# EasyEDA Pro project 无线充电发射端.epro, board PCB1
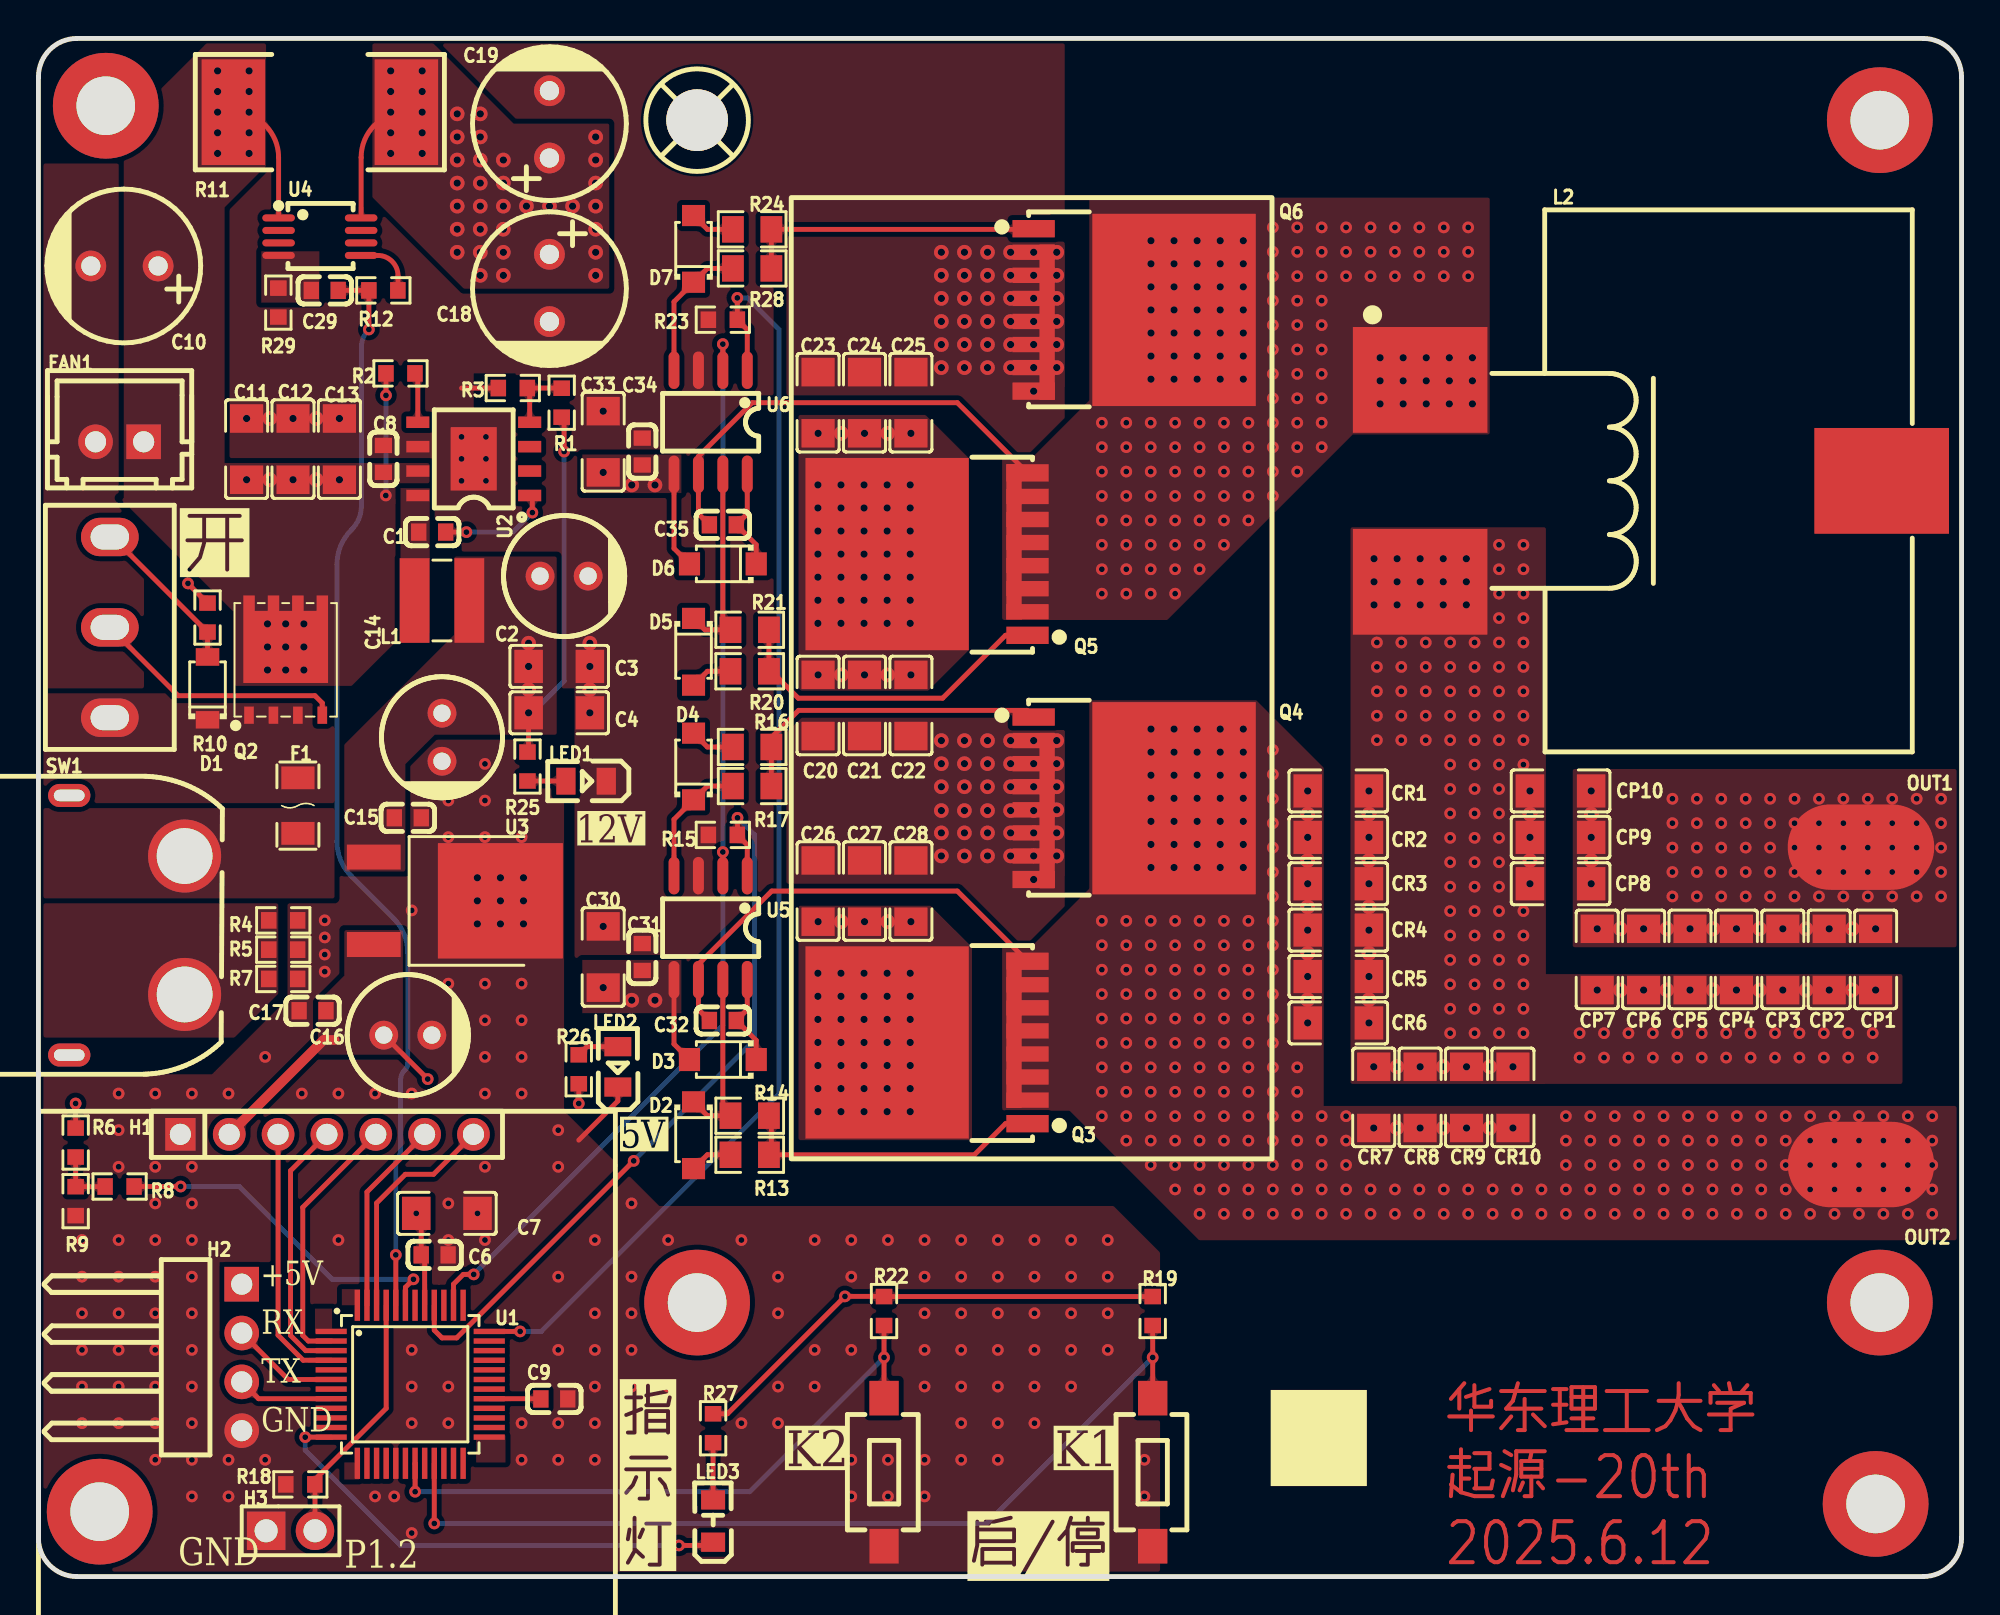
[diagram p1: board, top side]
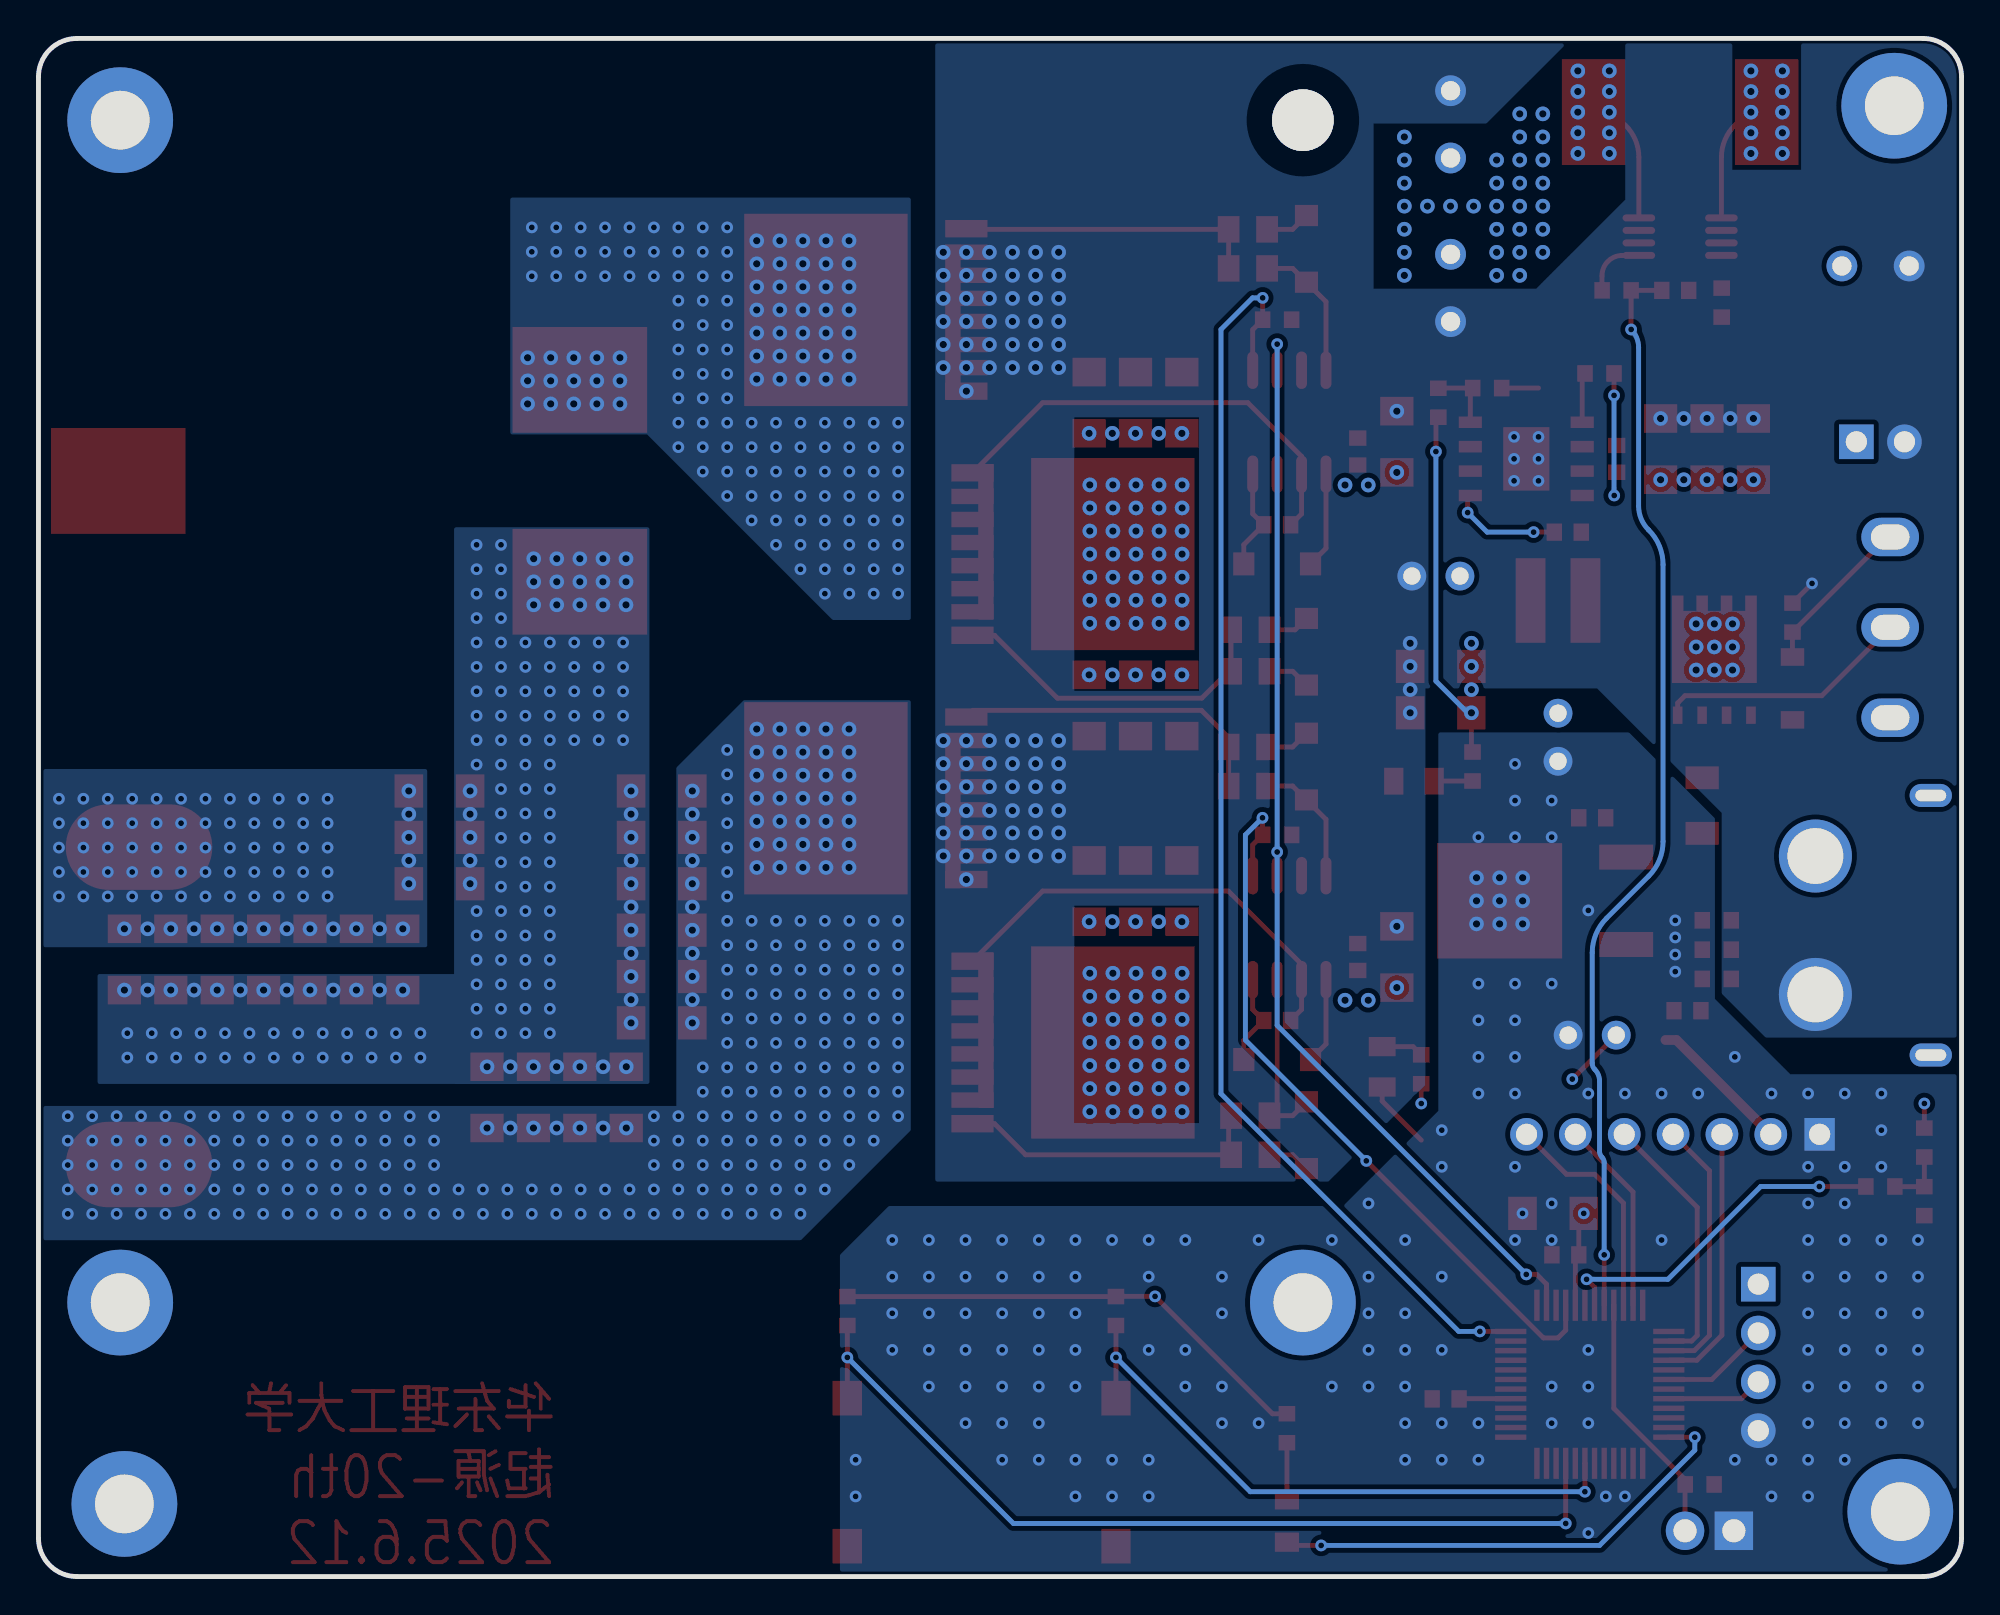
[diagram p2: board, bottom side, seen from below]

Outline 100 x 80 mm; copper layers: Top Layer, GND层, 电源层, Bottom Layer. Coordinates in mm from the lower left corner of the outline.
Outline path: 0,78 0,2 arc(0.59,0.59) 2,0 98,0 arc(99.41,0.59) 100,2 100,78 arc(99.41,79.41) 98,80 2,80 arc(0.59,79.41) 0,78
Stack: Top Layer 0.035mm 外层铜厚1oz / Dielectric1 0.2104mm 7628 RC49% 8.6mil / GND层 0.0152mm 内层铜厚 / Dielectric2 1.065mm 1.1mm H/HOZ Copper / 电源层 0.0152mm 内层铜厚 / Dielectric3 0.2104mm 7628 RC49% 8.6mil / Bottom Layer 0.035mm 外层铜厚1oz

## Design rules (mm)
template: xyf_v1.1
spacing copperThickness1oz (default): track to track 0.102, other pairs 0.152 to 0.3
spacing copperThickness2oz: track to track 0.203, other pairs 0.152 to 0.3
spacing 0焊盘板框间距: track to track 0.152, other pairs 0 to 0.3
spacing copperThicknessInner0.5oz: track to track 0.089, other pairs 0.152 to 0.3
track width copperThickness1oz (default): min 0.127, default 0.254, max 2.54
track width copperThickness2oz: min 0.203, default 0.254, max 2.54
track width copperThickness0.5oz: min 0.089, default 0.254, max 2.54
differential pair differentialPair (default): width min 0.127, default 0.254, max 2.54; gap min 0.152, default 0.152
via viaSize (default): diameter min 0.5, default 0.61, max 10; hole min 0.3, default 0.305, max 6.3
via viaSize2: diameter min 0.5, default 0.61, max 10; hole min 0.3, default 0.305, max 6.299
via viaSize4: diameter min 0.45, default 0.61, max 10; hole min 0.3, default 0.305, max 6.299

## Placement (name value [footprint] x y rotation side)
C1  100nF  [C0603]  20.47 54.32 0 top
C2  150uF  [CAP-TH_BD6.3-P2.50-D0.5-FD]  27.33 52.04 0 top
C3  10uF  [C1206]  27.08 47.34 180 top
C4  10uF  [C1206]  27.08 44.92 180 top
C6  100nF  [C0603]  20.6 16.73 180 top
C7  10uF  [C1206]  21.24 18.89 180 top
C8  100nF  [C0603]  17.94 58.13 270 top
C9  100nF  [C0603]  26.83 9.24 0 top
C10  220uF  [CAP-TH_BD8.0-P3.50-D0.6-FD]  4.47 68.17 180 top
C11  10uF  [C1206]  10.82 58.64 270 top
C12  10uF  [C1206]  13.24 58.64 270 top
C13  10uF  [C1206]  15.65 58.64 270 top
C14  150uF  [CAP-TH_BD6.3-P2.50-D0.5-FD]  20.98 43.66 270 top
C15  100nF  [C0603]  19.2 39.46 180 top
C16  150uF  [CAP-TH_BD6.3-P2.50-D0.5-FD]  19.2 28.16 0 top
C17  100nF  [C0603]  14.25 29.43 0 top
C18  220uF  [CAP-TH_BD8.0-P3.50-D0.6-FD]  26.57 67.02 270 top
C19  220uF  [CAP-TH_BD8.0-P3.50-D0.6-FD]  26.57 75.53 90 top
C20  10uF  [C1206]  40.54 45.31 270 top
C21  10uF  [C1206]  42.95 45.31 270 top
C22  10uF  [C1206]  45.37 45.31 270 top
C23  10uF  [C1206]  40.54 61.05 90 top
C24  10uF  [C1206]  42.95 61.05 90 top
C25  10uF  [C1206]  45.37 61.05 90 top
C26  10uF  [C1206]  40.54 35.65 90 top
C27  10uF  [C1206]  42.95 35.65 90 top
C28  10uF  [C1206]  45.37 35.65 90 top
C29  100nF  [C0603]  14.89 66.9 0 top
C30  10uF  [C1206]  29.37 32.22 270 top
C31  100nF  [C0603]  31.4 32.22 270 top
C32  100nF  [C0603]  35.59 28.92 180 top
C33  10uF  [C1206]  29.37 59.02 270 top
C34  100nF  [C0603]  31.4 58.51 270 top
C35  100nF  [C0603]  35.59 54.7 180 top
CN1  XT60PW-M  [CONN-TH_XT60PW-M]  4.6 33.88 0 top
CP1  1nF  [C1206]  95.53 32.1 270 top
CP2  1nF  [C1206]  93.12 32.1 270 top
CP3  1nF  [C1206]  90.71 32.1 270 top
CP4  4.3nF  [C1206]  88.29 32.1 270 top
CP5  4.3nF  [C1206]  85.88 32.1 270 top
CP6  4.3nF  [C1206]  83.47 32.1 270 top
CP7  4.3nF  [C1206]  81.05 32.1 270 top
CP8  10nF  [C1206]  79.15 36.03 180 top
CP9  10nF  [C1206]  79.15 38.45 180 top
CP10  10nF  [C1206]  79.15 40.86 180 top
CR1  68nF  [C1206]  67.59 40.86 180 top
CR2  68nF  [C1206]  67.59 38.45 180 top
CR3  68nF  [C1206]  67.59 36.03 180 top
CR4  10nF  [C1206]  67.59 33.62 0 top
CR5  10nF  [C1206]  67.59 31.21 0 top
CR6  10nF  [C1206]  67.59 28.8 0 top
CR7  10nF  [C1206]  69.43 24.92 90 top
CR8  1nF  [C1206]  71.85 24.92 90 top
CR9  1nF  [C1206]  74.26 24.92 90 top
CR10  1nF  [C1206]  76.67 24.92 90 top
D1  BZT52C12  [SOD-123_L2.7-W1.6-LS3.7-RD]  8.79 46.19 90 top
D2  1N5819HW  [SOD-123_L2.7-W1.6-LS3.8-RD]  34.06 22.95 270 top
D3  1N5819HW  [SOD-123_L2.7-W1.6-LS3.8-RD]  35.59 26.89 180 top
D4  1N5819HW  [SOD-123_L2.7-W1.6-LS3.8-RD]  34.06 42.13 90 top
D5  1N5819HW  [SOD-123_L2.7-W1.6-LS3.8-RD]  34.06 48.1 270 top
D6  1N5819HW  [SOD-123_L2.7-W1.6-LS3.8-RD]  35.59 52.67 180 top
D7  1N5819HW  [SOD-123_L2.7-W1.6-LS3.8-RD]  34.06 69.06 90 top
F1  JFC1206-2300FS  [F1206]  13.49 40.1 90 top
FAN1  ZX-XH2.54-2PZZ  [CONN-TH_2P-P2.50_HX25003-2A]  4.22 59.02 180 top
H1  PM254V-11-07-H85  [HDR-TH_7P-P2.54-V-F]  15 23 0 top
H2  PZ254R-11-04P  [HDR-TH_4P-P2.54-H-M-W10.4]  10.57 11.4 270 top
H3  PZ254V-11-02P  [HDR-TH_2P-P2.54-V-M]  13.11 2.38 0 top
K1  TS3625A  [KEY-SMD_L6.0-W3.5-LS8.4]  57.94 5.43 90 top
K2  TS3625A  [KEY-SMD_L6.0-W3.5-LS8.4]  43.97 5.43 90 top
L1  10uH  [IND-SMD_L4.1-W4.1_FTC404020S]  20.98 50.77 0 top
L2  4.7uH  [IND-SMD_3P-L28.0-W19.0-LS27.0]  83.85 56.99 270 top
LED1  NCD0805G1  [LED0805-R-RD]  28.48 41.37 180 top
LED2  NCD0805G1  [LED0805-R-RD]  30.13 26.51 90 top
LED3  XL-2012UPC  [LED0805-RD_PINK]  35.08 2.89 90 top
OUT1  -  [Test-Point-0.5mm]  94.77 37.94 0 top
OUT2  -  [Test-Point-0.5mm]  94.77 21.43 0 top
Q2  AGM60P100A  [TDSON-8_L5.9-W5.2-P1.27-BL]  12.86 46.58 0 top
Q3  HYG016N10NS1TA  [TOLL-8_L10.4-W9.9-P1.20-LS11.7-BL]  47.78 27.78 90 top
Q4  HYG016N10NS1TA  [TOLL-8_L10.4-W9.9-P1.20-LS11.7-BL]  55.4 40.48 270 top
Q5  HYG016N10NS1TA  [TOLL-8_L10.4-W9.9-P1.20-LS11.7-BL]  47.78 53.18 90 top
Q6  HYG016N10NS1TA  [TOLL-8_L10.4-W9.9-P1.20-LS11.7-BL]  55.4 65.88 270 top
QR1  -  [JLC-QRCODE-5x5]  66.58 7.21 0 top
R1  143kΩ  [R0603]  27.21 61.05 270 top
R2  10kΩ  [R0603]  18.82 62.58 0 top
R3  10kΩ  [R0603]  24.67 61.82 0 top
R4  0Ω  [R0603]  12.73 34.13 180 top
R5  0Ω  [R0603]  12.73 32.61 180 top
R6  10kΩ  [R0603]  1.93 22.57 90 top
R7  0Ω  [R0603]  12.73 31.08 180 top
R8  2kΩ  [R0603]  4.22 20.29 180 top
R9  1kΩ  [R0603]  1.93 19.53 90 top
R10  10kΩ  [R0603]  8.79 49.88 90 top
R11  5mΩ  [RES-SMD_L10.0-W5.2]  14.63 76.17 180 top
R12  10kΩ  [R0603]  17.94 66.9 0 top
R13  27Ω  [R0805]  36.99 21.94 0 top
R14  27Ω  [R0805]  36.99 23.97 0 top
R15  510kΩ  [R0603]  35.59 38.58 0 top
R16  27Ω  [R0805]  37.11 43.15 0 top
R17  27Ω  [R0805]  37.11 41.11 0 top
R18  10kΩ  [R0603]  13.62 4.79 0 top
R19  1kΩ  [R0603]  57.94 13.81 270 top
R20  27Ω  [R0805]  36.99 47.08 0 top
R21  27Ω  [R0805]  36.99 49.24 0 top
R22  1kΩ  [R0603]  43.97 13.81 270 top
R23  510kΩ  [R0603]  35.59 65.37 0 top
R24  27Ω  [R0805]  37.11 70.07 0 top
R25  4.7kΩ  [R0603]  25.43 42.13 90 top
R26  4.7kΩ  [R0603]  28.09 26.38 270 top
R27  4.7kΩ  [R0603]  35.08 7.71 90 top
R28  27Ω  [R0805]  37.11 68.04 0 top
R29  0Ω  [R0603]  12.47 66.26 90 top
SCREW1  -  [M3螺丝]  3.5 76.5 0 top
SCREW2  -  [M3螺丝#2]  34.25 75.75 0 top
SCREW3  -  [M3螺丝]  95.75 75.75 0 top
SCREW4  -  [M3螺丝]  3.18 3.37 0 top
SCREW5  -  [M3螺丝]  34.25 14.25 0 top
SCREW6  -  [M3螺丝]  95.75 14.25 0 top
SCREW7  -  [M3螺丝]  95.53 3.78 0 top
SW1  SS-12D10L5  [SW-TH_SS-12D10L5]  3.71 49.37 270 top
U1  AI8051U-34K64-QFP48  [LQFP-48_L7.0-W7.0-P0.50-LS9.0-BL_1]  19.33 10 270 top
U2  SCT2433STER  [ESOP-8_L4.9-W3.9-P1.27-LS6.0-BL-EP]  22.63 58.13 90 top
U3  MC7805BDTRKG  [TO-252-2_L6.6-W6.1-P4.57-LS9.9-TL-CW]  20.73 35.15 0 top
U4  AD8217BRMZ-R7  [MSOP-8_L3.0-W3.0-P0.65-LS5.0-BL]  14.63 69.69 270 top
U5  IR2184STRPBF  [SOIC-8_L5.0-W4.0-P1.27-LS6.0-BL]  34.95 33.75 180 top
U6  IR2184STRPBF  [SOIC-8_L5.0-W4.0-P1.27-LS6.0-BL]  34.95 60.04 180 top

## Footprints (pads in the part's own frame, mm; a bottom-side part is the same pattern mirrored in y, then rotated)
C0603
  rect 0.8x0.9 smd: 1(-0.7,0) 2(0.7,0)
C1206
  rect 1.485x1.728 smd: 1(-1.593,0) 2(1.593,0)
CAP-TH_BD6.3-P2.50-D0.5-FD
  round 1.5 hole 0.9: 1(-1.25,0) 2(1.25,0)
CAP-TH_BD8.0-P3.50-D0.6-FD
  round 1.6 hole 1: 1(-1.75,0) 2(1.75,0)
CONN-TH_2P-P2.50_HX25003-2A
  rect 1.8x1.8 hole 1.1: 1(-1.25,0)
  round 1.8 hole 1.1: 2(1.25,0)
CONN-TH_XT60PW-M
  round 3.8 hole 2.9: 1(3,-3.6) 2(3,3.6)
  oval 2.2x1.2 hole 1.6x0.6: 3(-3,6.75) 4(-3,-6.75)
ESOP-8_L4.9-W3.9-P1.27-LS6.0-BL-EP
  rect 0.6x1.2 smd: 1(-1.905,-2.909) 2(-0.635,-2.909) 3(0.635,-2.909) 4(1.905,-2.909) 5(1.905,2.909) 6(0.635,2.909) 7(-0.635,2.909) 8(-1.905,2.909)
  rect 3.3x2.4 smd: 9(0,0)
F1206
  rect 1.19x1.728 smd: 1(-1.445,0) 2(1.445,0)
HDR-TH_2P-P2.54-V-M
  rect 2x2 hole 1.2: 1(-1.27,0)
  round 2 hole 1.2: 2(1.27,0)
HDR-TH_4P-P2.54-H-M-W10.4
  rect 1.8x1.8 hole 1.1: 1(-3.81,0)
  round 1.8 hole 1.1: 2(-1.27,0) 3(1.27,0) 4(3.81,0)
HDR-TH_7P-P2.54-V-F
  rect 1.575x1.7 hole 1.1: 1(-7.62,0)
  round 1.7 hole 1.1: 2(-5.08,0) 3(-2.54,0) 4(0,0) 5(2.54,0) 6(5.08,0) 7(7.62,0)
IND-SMD_3P-L28.0-W19.0-LS27.0
  rect 5.5x7 smd: 1(-5.25,-12) 2(5.25,-12) 3(0,12)
IND-SMD_L4.1-W4.1_FTC404020S
  rect 1.55x4.4 smd: 1(-1.425,0) 2(1.425,0)
KEY-SMD_L6.0-W3.5-LS8.4
  rect 1.8x1.524 smd: 1(-3.85,0) 2(3.85,0)
LED0805-R-RD
  rect 1x1.399 smd: 1(1.05,0) 2(-1.05,0)
LED0805-RD_PINK
  rect 1x1.25 smd: 1(-1.1,0) 2(1.1,0)
LQFP-48_L7.0-W7.0-P0.50-LS9.0-BL_1
  rect 0.28x1.62 smd: 1(-2.75,-4.11) 2(-2.25,-4.11) 3(-1.75,-4.11) 4(-1.25,-4.11) 5(-0.75,-4.11) 6(-0.25,-4.11) 7(0.25,-4.11) 8(0.75,-4.11) 9(1.25,-4.11) 10(1.75,-4.11) 11(2.25,-4.11) 12(2.75,-4.11) 25(2.75,4.11) 26(2.25,4.11) 27(1.75,4.11) 28(1.25,4.11) 29(0.75,4.11) 30(0.25,4.11) 31(-0.25,4.11) 32(-0.75,4.11) 33(-1.25,4.11) 34(-1.75,4.11) 35(-2.25,4.11) 36(-2.75,4.11)
  rect 1.62x0.28 smd: 13(4.11,-2.75) 14(4.11,-2.25) 15(4.11,-1.75) 16(4.11,-1.25) 17(4.11,-0.75) 18(4.11,-0.25) 19(4.11,0.25) 20(4.11,0.75) 21(4.11,1.25) 22(4.11,1.75) 23(4.11,2.25) 24(4.11,2.75) 37(-4.11,2.75) 38(-4.11,2.25) 39(-4.11,1.75) 40(-4.11,1.25) 41(-4.11,0.75) 42(-4.11,0.25) 43(-4.11,-0.25) 44(-4.11,-0.75) 45(-4.11,-1.25) 46(-4.11,-1.75) 47(-4.11,-2.25) 48(-4.11,-2.75)
M3螺丝
  round 5.5 hole 3.05: 1(0,0)
M3螺丝#2
  round 3.2 hole 3.2: 1(0,0)
MSOP-8_L3.0-W3.0-P0.65-LS5.0-BL
  oval 0.364x1.692 smd: 1(-0.975,-2.146) 2(-0.325,-2.146) 3(0.325,-2.146) 4(0.975,-2.146) 5(0.975,2.146) 6(0.325,2.146) 7(-0.325,2.146) 8(-0.975,2.146)
R0603
  rect 0.806x0.864 smd: 1(-0.753,0) 2(0.753,0)
R0805
  rect 1.133x1.377 smd: 1(-1,0) 2(1,0)
RES-SMD_L10.0-W5.2
  rect 3.3x5.5 smd: 1(-4.5,0) 2(4.5,0)
SOD-123_L2.7-W1.6-LS3.7-RD
  rect 0.91x1.22 smd: 1(-1.635,0) 2(1.635,0)
SOD-123_L2.7-W1.6-LS3.8-RD
  rect 1.1x1.2 smd: 1(-1.735,0) 2(1.735,0)
SOIC-8_L5.0-W4.0-P1.27-LS6.0-BL
  oval 0.569x1.95 smd: 1(-1.905,-2.705) 2(-0.635,-2.705) 3(0.635,-2.705) 4(1.905,-2.705) 5(1.905,2.705) 6(0.635,2.705) 7(-0.635,2.705) 8(-1.905,2.705)
SW-TH_SS-12D10L5
  oval 2x3 hole 1.3x2: 1(-4.7,0) 2(0,0) 3(4.7,0)
TDSON-8_L5.9-W5.2-P1.27-BL
  rect 0.5x0.9 smd: 1(-1.905,-1.775) 2(-0.635,-1.775) 3(0.635,-1.775) 4(1.905,-1.775)
  custom 4.41x4.55 smd: 5(0,1.775)
Test-Point-0.5mm
  oval 7.62x4.445 smd: 1(0,0)
TO-252-2_L6.6-W6.1-P4.57-LS9.9-TL-CW
  rect 2.8x1.3 smd: 1(-3.292,2.273) 3(-3.292,-2.273)
  rect 6.5x6 smd: 2(3.292,0)
TOLL-8_L10.4-W9.9-P1.20-LS11.7-BL
  rect 0.9x2.2 smd: 1(-4.225,-3.65) 8(4.225,-3.65)
  rect 0.8x2.2 smd: 2(-3,-3.65) 3(-1.8,-3.65) 4(-0.6,-3.65) 5(0.6,-3.65) 6(1.8,-3.65) 7(3,-3.65)
  rect 8.08x0.8 smd: 8(0.64,-2.95)
  rect 10x8.5 smd: 9(0,3.65)

## Nets
As in the schematic.

Pads without a net: CN1 3 4; L2 3; SCREW1 1; SCREW2 1; SCREW3 1; SCREW4 1; SCREW5 1; SCREW6 1; SCREW7 1; U2 2 3; U4 2 3 6 7

## Via types
v1: diameter 0.61, hole 0.305, Top Layer to Bottom Layer, 676 vias
v2: diameter 0.762, hole 0.381, Top Layer to Bottom Layer, 426 vias

## Routing (per net, layer and track width the routed paths; a pad name or vN(x,y) marks a point on that pad's centre or on a via; arc(x,y) is an arc through that point)
+5V: length 93.6
  Top Layer w0.254: R19.1 R22.1 43.96,14.57 v1(41.94,14.57) 35.83,8.47 R27.2 ; R26.2 v1(28.09,24.61) ; v1(19.64,18.89) 19.9,18.63 C6.2 20.08,16.55 U1.41 ; C16.1 v1(20.24,25.88)
  Top Layer w0.508: H1.2 14.83,27.91 15.39,27.91
  电源层 w0.254: v1(28.09,24.61) 27.71,24.22 25.05,24.22 ; 25.05,24.22 23.4,25.88 v1(20.24,25.88) ; 25.05,24.22 25.05,20.16 26.44,18.76 37.75,18.76 v1(41.94,14.57) ; v1(19.64,18.89) 14.03,18.89 H1.2 9.92,15.86 H2.1
+12V: length 27.8
  Top Layer w0.254: U6.5 33.05,53.48 D6.2 ; v2(25.49,44.92) 25.49,42.94 R25.2 ; D3.2 33.05,27.7 U5.5 ; R1.2 27.33,60.17 v1(27.33,58.51)
  Bottom Layer w0.254: 25.56,44.92 25.68,44.92 27.33,46.58 v1(27.33,58.51)
  vias: v2(25.49,48.54) v2(25.49,47.34) v2(25.49,46.13) v2(29.37,57.43) v2(29.37,30.63) v2(30.85,56.77) v2(30.85,29.98) v2(32.06,56.77) v2(32.06,29.98)
+24V: length 42.3
  Top Layer w0.254: R2.1 v1(18.07,61.44) ; R6.2 v1(1.93,24.61) ; U4.1 12.49,73.81 arc(11.8,75.48) R11.2
  电源层 w0.254: v2(11.91,47.15) 10,47.15 3.71,40.86 3.71,26.38 v1(1.93,24.61)
  Bottom Layer w0.254: v1(18.07,61.44) 18.07,56.24 v1(18.06,56.23)
  vias: v2(9.31,78.31) v2(9.31,77.24) v2(9.31,76.17) v2(9.31,75.09) v2(9.31,74.02) v2(10.82,57.05) v2(10.95,78.31) v2(10.95,77.24) v2(10.95,76.17) v2(10.95,75.09) v2(10.95,74.02) v2(11.91,49.55) v2(11.91,48.35) v2(12.03,57.05) v2(12.86,49.55) v2(12.86,48.35) v2(12.86,47.15) v2(13.24,57.05) v2(13.8,49.55) v2(13.8,48.35) v2(13.8,47.15) v2(14.44,57.05) v2(15.65,57.05)
GND: length 3.6
  Top Layer w0.254: LED2.2 30.13,24.73 28.09,22.7
  vias: v1(2.26,17.5) v1(2.26,15.6) v1(2.26,13.69) v1(2.26,11.79) v1(2.26,9.88) v1(2.26,7.98) v1(4.17,25.12) v1(4.17,23.22) v1(4.17,21.31) v1(4.17,17.5) v1(4.17,15.6) v1(4.17,13.69) v1(4.17,11.79) v1(4.17,9.88) v1(4.17,7.98) v1(6.07,25.12) v1(6.07,21.31) v1(6.07,19.41) v1(6.07,17.5) v1(6.07,15.6) v1(6.07,13.69) v1(6.07,11.79) v1(6.07,9.88) v1(6.07,7.98) v1(6.07,6.07) v1(7.98,25.12) v1(7.98,21.31) v1(7.98,19.41) v1(7.98,17.5) v1(7.98,15.6) v1(7.98,13.69) v1(7.98,11.79) v1(7.98,9.88) v1(7.98,7.98) v1(7.98,6.07) v1(7.98,4.17) v1(9.88,25.12) v1(9.88,6.07) v1(9.88,4.17) v1(11.79,27.03) v1(11.79,6.07) v1(13.69,25.12) v1(14.89,34.13) v1(14.89,33.24) v1(14.89,32.35) v1(14.89,31.46) v1(15.6,25.12) v1(15.6,17.5) v1(17.5,25.12) v1(17.5,4.17) v1(18.5,4.17) v1(19.41,34.65) v1(19.41,25.12) v1(19.41,11.79) v1(19.41,9.88) v1(19.41,7.98) v1(19.41,2.26) v1(21.31,40.36) v1(21.31,38.46) v1(21.31,30.84) v1(21.31,19.41) v1(21.31,17.5) v1(21.31,9.88) v1(21.31,7.98) v1(22.83,18.89) v1(23.22,42.27) v1(23.22,40.36) v1(23.22,38.46) v1(23.22,30.84) v1(23.22,28.93) v1(23.22,27.03) v1(23.22,25.12) v1(23.22,21.31) v1(23.22,17.5) v1(25.12,38.46) v1(25.12,30.84) v1(25.12,28.93) v1(25.12,27.03) v1(25.12,25.12) v1(25.12,7.98) v1(25.12,6.07) v1(27.03,23.22) v1(27.03,21.31) v1(27.03,15.6) v1(27.03,11.79) v1(27.03,7.98) v1(27.03,6.07) v1(28.93,17.5) v1(28.93,13.69) v1(28.93,11.79) v1(28.93,9.88) v1(28.93,7.98) v1(28.93,6.07) v1(30.84,19.41) v1(30.84,15.6) v1(30.84,13.69) v1(30.84,11.79) v1(30.84,9.88) v1(32.74,17.5) v1(32.74,9.88) v1(36.55,17.5) v1(36.55,7.98) v1(38.46,15.6) v1(38.46,13.69) v1(38.46,9.88) v1(38.46,7.98) v1(40.36,17.5) v1(40.36,11.79) v1(40.36,9.88) v1(42.27,17.5) v1(42.27,15.6) v1(42.27,11.79) v1(42.27,6.07) v1(42.27,4.17) v1(44.17,17.5) v1(44.17,6.07) v1(44.17,4.17) v1(46.08,17.5) v1(46.08,15.6) v1(46.08,13.69) v1(46.08,11.79) v1(46.08,9.88) v1(46.08,6.07) v1(46.08,4.17) v1(47.98,17.5) v1(47.98,15.6) v1(47.98,13.69) v1(47.98,11.79) v1(47.98,9.88) v1(47.98,7.98) v1(47.98,6.07) v1(49.89,17.5) v1(49.89,15.6) v1(49.89,13.69) v1(49.89,11.79) v1(49.89,9.88) v1(49.89,7.98) v1(49.89,6.07) v1(51.79,17.5) v1(51.79,15.6) v1(51.79,13.69) v1(51.79,11.79) v1(51.79,9.88) v1(51.79,7.98) v1(53.7,17.5) v1(53.7,15.6) v1(53.7,13.69) v1(53.7,11.79) v1(53.7,9.88) v1(55.6,17.5) v1(55.6,15.6) v1(55.6,13.69) v1(55.6,11.79) v1(57.51,6.07) v1(57.51,4.17) v2(22.82,36.35) v2(22.82,35.15) v2(22.82,33.95) v2(24.02,36.35) v2(24.02,35.15) v2(24.02,33.95) v2(25.22,36.35) v2(25.22,35.15) v2(25.22,33.95)
PGND: length 3.4
  Top Layer w0.254: R10.2 7.78,51.65 v1(7.78,51.66) ; R3.1 22,61.82
  vias: v1(22,59.28) v1(22,58.13) v1(22,56.99) v1(23.27,59.28) v1(23.27,58.13) v1(23.27,56.99) v2(10.82,60.23) v2(12.03,60.23) v2(13.24,60.23) v2(14.44,60.23) v2(15.65,60.23) v2(28.67,48.54) v2(28.67,47.34) v2(28.67,46.13) v2(28.67,44.92) v2(29.37,60.61) v2(29.37,33.82) v2(46.95,68.88) v2(46.95,67.68) v2(46.95,66.48) v2(46.95,65.28) v2(46.95,64.08) v2(46.95,62.88) v2(46.95,43.48) v2(46.95,42.28) v2(46.95,41.08) v2(46.95,39.84) v2(46.95,38.68) v2(46.95,37.48) v2(48.15,68.88) v2(48.15,67.68) v2(48.15,66.48) v2(48.15,65.28) v2(48.15,64.08) v2(48.15,62.88) v2(48.15,43.48) v2(48.15,42.28) v2(48.15,41.08) v2(48.15,39.84) v2(48.15,38.68) v2(48.15,37.48) v2(49.35,68.88) v2(49.35,67.68) v2(49.35,66.48) v2(49.35,65.28) v2(49.35,64.08) v2(49.35,62.88) v2(49.35,43.48) v2(49.35,42.28) v2(49.35,41.08) v2(49.35,39.84) v2(49.35,38.68) v2(49.35,37.48) v2(50.55,68.88) v2(50.55,67.68) v2(50.55,66.48) v2(50.55,65.28) v2(50.55,64.08) v2(50.55,62.88) v2(50.55,43.48) v2(50.55,42.28) v2(50.55,41.08) v2(50.55,39.84) v2(50.55,38.68) v2(50.55,37.48) v2(51.75,68.88) v2(51.75,67.68) v2(51.75,66.48) v2(51.75,65.28) v2(51.75,64.08) v2(51.75,62.88) v2(51.75,61.66) v2(51.75,43.48) v2(51.75,42.28) v2(51.75,41.08) v2(51.75,39.84) v2(51.75,38.68) v2(51.75,37.48) v2(51.75,36.25) v2(52.95,68.88) v2(52.95,67.68) v2(52.95,66.48) v2(52.95,65.28) v2(52.95,64.08) v2(52.95,62.88) v2(52.95,43.48) v2(52.95,42.28) v2(52.95,41.08) v2(52.95,39.88) v2(52.95,38.68) v2(52.95,37.48)
ADC1: length 56.3
  Top Layer w0.254: U1.44 v1(18.58,16.73) ; C29.2 R12.1 v1(17.18,64.86)
  Bottom Layer w0.254: v1(18.58,16.73) 18.58,21.53 arc(18.61,21.68) 18.7,21.81 arc(18.79,21.95) 18.82,22.12 18.82,25.77 arc(18.89,26.1) 19.08,26.38 arc(19.17,26.52) 19.2,26.69 19.2,32.44 arc(19.01,33.42) 18.46,34.24 16.27,36.43 arc(15.72,37.26) 15.52,38.23 15.52,52.64 arc(15.72,53.61) 16.27,54.43 16.28,54.45 arc(16.66,55.01) 16.79,55.68 16.79,63.92 arc(16.89,64.43) v1(17.18,64.86)
ADC_BAT: length 18
  Top Layer w0.254: v1(19.5,15.46) 19.08,15.04 U1.43 ; R8.1 v1(7.39,20.29)
  Bottom Layer w0.254: v1(19.5,15.46) 15.27,15.46 10.44,20.29 v1(7.39,20.29)
IO1: length 58.7
  Top Layer w0.254: U1.38 21.58,15.21 22.09,15.72 v1(22.63,15.72) ; U5.2 v1(35.59,37.69) ; U6.2 v1(35.59,64.1)
  Bottom Layer w0.254: v1(35.59,64.1) v1(35.59,37.69) 35.59,28.67 v1(22.63,15.72)
KEY0: length 47.8
  Top Layer w0.254: R19.2 v1(57.94,11.4) K1.2 ; U1.21 v1(20.58,2.76)
  Bottom Layer w0.254: v1(57.94,11.4) 49.3,2.76 v1(20.58,2.76)
KEY1: length 32.5
  Top Layer w0.254: K2.2 v1(43.97,11.4) R22.2 ; U1.19 19.59,5.89 v1(19.59,4.41)
  Bottom Layer w0.254: v1(43.97,11.4) 36.99,4.41 v1(19.59,4.41)
OUT1: length 23.6
  Top Layer w0.254: Q5.8 47.78,61.05 37.11,61.05 34.32,58.26 U6.6 34.32,55.27 C35.2
  vias: v1(55.3,60.01) v1(55.3,58.74) v1(55.3,57.47) v1(55.3,56.2) v1(55.3,54.93) v1(55.3,53.66) v1(55.3,52.39) v1(55.3,51.12) v1(56.57,60.01) v1(56.57,58.74) v1(56.57,57.47) v1(56.57,56.2) v1(56.57,54.93) v1(56.57,53.66) v1(56.57,52.39) v1(56.57,51.12) v1(57.84,60.01) v1(57.84,58.74) v1(57.84,57.47) v1(57.84,56.2) v1(57.84,54.93) v1(57.84,53.66) v1(57.84,52.39) v1(57.84,51.12) v1(59.11,60.01) v1(59.11,58.74) v1(59.11,57.47) v1(59.11,56.2) v1(59.11,54.93) v1(59.11,53.66) v1(59.11,52.39) v1(59.11,51.12) v1(60.38,60.01) v1(60.38,58.74) v1(60.38,57.47) v1(60.38,56.2) v1(60.38,54.93) v1(60.38,53.66) v1(60.38,52.39) v1(61.65,60.01) v1(61.65,58.74) v1(61.65,57.47) v1(61.65,56.2) v1(61.65,54.93) v1(61.65,53.66) v1(62.92,60.01) v1(62.92,58.74) v1(62.92,57.47) v1(62.92,56.2) v1(62.92,54.93) v1(64.19,70.17) v1(64.19,68.9) v1(64.19,67.63) v1(64.19,66.36) v1(64.19,65.09) v1(64.19,63.82) v1(64.19,62.55) v1(64.19,61.28) v1(64.19,60.01) v1(64.19,58.74) v1(64.19,57.47) v1(64.19,56.2) v1(65.46,70.17) v1(65.46,68.9) v1(65.46,67.63) v1(65.46,66.36) v1(65.46,65.09) v1(65.46,63.82) v1(65.46,62.55) v1(65.46,61.28) v1(65.46,60.01) v1(65.46,58.74) v1(65.46,57.47) v1(66.73,70.17) v1(66.73,68.9) v1(66.73,67.63) v1(66.73,66.36) v1(66.73,65.09) v1(66.73,63.82) v1(66.73,62.55) v1(66.73,61.28) v1(66.73,60.01) v1(66.73,58.74) v1(68,70.17) v1(68,68.9) v1(68,67.63) v1(69.27,70.17) v1(69.27,68.9) v1(69.27,67.63) v1(70.54,70.17) v1(70.54,68.9) v1(70.54,67.63) v1(71.81,70.17) v1(71.81,68.9) v1(71.81,67.63) v1(73.08,70.17) v1(73.08,68.9) v1(73.08,67.63) v1(74.35,70.17) v1(74.35,68.9) v1(74.35,67.63) v2(57.85,69.48) v2(57.85,68.28) v2(57.85,67.08) v2(57.85,65.88) v2(57.85,64.68) v2(57.85,63.48) v2(57.85,62.28) v2(59.05,69.48) v2(59.05,68.28) v2(59.05,67.08) v2(59.05,65.88) v2(59.05,64.68) v2(59.05,63.48) v2(59.05,62.28) v2(60.25,69.48) v2(60.25,68.28) v2(60.25,67.08) v2(60.25,65.88) v2(60.25,64.68) v2(60.25,63.48) v2(60.25,62.28) v2(61.45,69.48) v2(61.45,68.28) v2(61.45,67.08) v2(61.45,65.88) v2(61.45,64.68) v2(61.45,63.48) v2(61.45,62.28) v2(62.65,69.48) v2(62.65,68.28) v2(62.65,67.08) v2(62.65,65.88) v2(62.65,64.68) v2(62.65,63.48) v2(62.65,62.28) v2(69.76,63.39) v2(69.76,62.19) v2(69.76,60.99) v2(70.96,63.39) v2(70.96,62.19) v2(70.96,60.99) v2(72.16,63.39) v2(72.16,62.19) v2(72.16,60.99) v2(73.36,63.39) v2(73.36,62.19) v2(73.36,60.99) v2(74.56,63.39) v2(74.56,62.19) v2(74.56,60.99)
OUT2: length 23.4
  Top Layer w0.254: Q3.8 47.78,35.65 38.13,35.65 34.32,31.84 U5.6 34.32,29.49 C32.2
  vias: v1(55.3,34.1) v1(55.3,32.83) v1(55.3,31.56) v1(55.3,30.29) v1(55.3,29.02) v1(55.3,27.75) v1(55.3,26.48) v1(55.3,25.21) v1(55.3,23.94) v1(56.57,34.1) v1(56.57,32.83) v1(56.57,31.56) v1(56.57,30.29) v1(56.57,29.02) v1(56.57,27.75) v1(56.57,26.48) v1(56.57,25.21) v1(56.57,23.94) v1(56.57,22.67) v1(57.84,34.1) v1(57.84,32.83) v1(57.84,31.56) v1(57.84,30.29) v1(57.84,29.02) v1(57.84,27.75) v1(57.84,26.48) v1(57.84,25.21) v1(57.84,23.94) v1(57.84,22.67) v1(57.84,21.4) v1(59.11,34.1) v1(59.11,32.83) v1(59.11,31.56) v1(59.11,30.29) v1(59.11,29.02) v1(59.11,27.75) v1(59.11,26.48) v1(59.11,25.21) v1(59.11,23.94) v1(59.11,22.67) v1(59.11,21.4) v1(59.11,20.13) v1(60.38,34.1) v1(60.38,32.83) v1(60.38,31.56) v1(60.38,30.29) v1(60.38,29.02) v1(60.38,27.75) v1(60.38,26.48) v1(60.38,25.21) v1(60.38,23.94) v1(60.38,22.67) v1(60.38,21.4) v1(60.38,20.13) v1(60.38,18.86) v1(61.65,34.1) v1(61.65,32.83) v1(61.65,31.56) v1(61.65,30.29) v1(61.65,29.02) v1(61.65,27.75) v1(61.65,26.48) v1(61.65,25.21) v1(61.65,23.94) v1(61.65,22.67) v1(61.65,21.4) v1(61.65,20.13) v1(61.65,18.86) v1(62.92,34.1) v1(62.92,32.83) v1(62.92,31.56) v1(62.92,30.29) v1(62.92,29.02) v1(62.92,27.75) v1(62.92,26.48) v1(62.92,25.21) v1(62.92,23.94) v1(62.92,22.67) v1(62.92,21.4) v1(62.92,20.13) v1(62.92,18.86) v1(64.19,42.99) v1(64.19,41.72) v1(64.19,40.45) v1(64.19,39.18) v1(64.19,37.91) v1(64.19,36.64) v1(64.19,35.37) v1(64.19,34.1) v1(64.19,32.83) v1(64.19,31.56) v1(64.19,30.29) v1(64.19,29.02) v1(64.19,27.75) v1(64.19,26.48) v1(64.19,25.21) v1(64.19,23.94) v1(64.19,22.67) v1(64.19,21.4) v1(64.19,20.13) v1(64.19,18.86) v1(65.46,26.48) v1(65.46,25.21) v1(65.46,23.94) v1(65.46,22.67) v1(65.46,21.4) v1(65.46,20.13) v1(65.46,18.86) v1(66.73,23.94) v1(66.73,22.67) v1(66.73,21.4) v1(66.73,20.13) v1(66.73,18.86) v1(68,23.94) v1(68,22.67) v1(68,21.4) v1(68,20.13) v1(68,18.86) v1(69.27,20.13) v1(69.27,18.86) v1(70.54,20.13) v1(70.54,18.86) v1(71.81,20.13) v1(71.81,18.86) v1(73.08,20.13) v1(73.08,18.86) v1(74.35,20.13) v1(74.35,18.86) v1(75.62,20.13) v1(75.62,18.86) v1(76.89,20.13) v1(76.89,18.86) v1(78.16,20.13) v1(78.16,18.86) v1(79.43,23.94) v1(79.43,22.67) v1(79.43,21.4) v1(79.43,20.13) v1(79.43,18.86) v1(80.7,23.94) v1(80.7,22.67) v1(80.7,21.4) v1(80.7,20.13) v1(80.7,18.86) v1(81.97,23.94) v1(81.97,22.67) v1(81.97,21.4) v1(81.97,20.13) v1(81.97,18.86) v1(83.24,23.94) v1(83.24,22.67) v1(83.24,21.4) v1(83.24,20.13) v1(83.24,18.86) v1(84.51,23.94) v1(84.51,22.67) v1(84.51,21.4) v1(84.51,20.13) v1(84.51,18.86) v1(85.78,23.94) v1(85.78,22.67) v1(85.78,21.4) v1(85.78,20.13) v1(85.78,18.86) v1(87.05,23.94) v1(87.05,22.67) v1(87.05,21.4) v1(87.05,20.13) v1(87.05,18.86) v1(88.32,23.94) v1(88.32,22.67) v1(88.32,21.4) v1(88.32,20.13) v1(88.32,18.86) v1(89.59,23.94) v1(89.59,22.67) v1(89.59,21.4) v1(89.59,20.13) v1(89.59,18.86) v1(90.86,23.94) v1(90.86,22.67) v1(90.86,21.4) v1(90.86,20.13) v1(90.86,18.86) v1(92.13,23.94) v1(92.13,22.67) v1(92.13,21.4) v1(92.13,20.13) v1(92.13,18.86) v1(93.4,23.94) v1(93.4,22.67) v1(93.4,21.4) v1(93.4,20.13) v1(93.4,18.86) v1(94.67,23.94) v1(94.67,22.67) v1(94.67,21.4) v1(94.67,20.13) v1(94.67,18.86) v1(95.94,23.94) v1(95.94,22.67) v1(95.94,21.4) v1(95.94,20.13) v1(95.94,18.86) v1(97.21,23.94) v1(97.21,22.67) v1(97.21,21.4) v1(97.21,20.13) v1(97.21,18.86) v1(98.48,23.94) v1(98.48,22.67) v1(98.48,21.4) v1(98.48,20.13) v1(98.48,18.86) v2(57.85,44.08) v2(57.85,42.88) v2(57.85,41.68) v2(57.85,40.48) v2(57.85,39.28) v2(57.85,38.08) v2(57.85,36.88) v2(59.05,44.08) v2(59.05,42.88) v2(59.05,41.68) v2(59.05,40.48) v2(59.05,39.28) v2(59.05,38.08) v2(59.05,36.88) v2(60.25,44.08) v2(60.25,42.88) v2(60.25,41.68) v2(60.25,40.48) v2(60.25,39.28) v2(60.25,38.08) v2(60.25,36.88) v2(61.45,44.08) v2(61.45,42.88) v2(61.45,41.68) v2(61.45,40.48) v2(61.45,39.28) v2(61.45,38.08) v2(61.45,36.88) v2(62.65,44.08) v2(62.65,42.88) v2(62.65,41.68) v2(62.65,40.48) v2(62.65,39.28) v2(62.65,38.08) v2(62.65,36.88) v2(66,40.86) v2(66,39.65) v2(66,38.45) v2(66,37.24) v2(66,36.03) v2(66,34.83) v2(66,33.62) v2(66,32.42) v2(66,31.21) v2(66,30) v2(66,28.8) v2(69.43,23.33) v2(70.64,23.33) v2(71.85,23.33) v2(73.05,23.33) v2(74.26,23.33) v2(75.47,23.33) v2(76.67,23.33)
P1.2: length 13.3
  Top Layer w0.254: U1.45 18.08,8.75 14.37,5.04 R18.2 14.38,4.78 14.38,2.38
P1.3: length 11.8
  Top Layer w0.254: H1.7 20.54,20.92 19.08,20.92 17.58,19.43 U1.46
P1.4: length 10.1
  Top Layer w0.254: H1.6 17.08,20 U1.47
P1.5: length 13.6
  Top Layer w0.254: U1.2 14.03,12.25 13.74,12.54 13.74,19.2 H1.5
P1.6: length 13.7
  Top Layer w0.254: U1.3 13.9,11.75 13.11,12.54 13.11,21.11 H1.4
P1.7: length 13.7
  Top Layer w0.254: H1.3 12.46,12.55 13.76,11.25 U1.4
P3.0: length 5.7
  Top Layer w0.254: H2.2 12.99,10.25 U1.6
P3.1: length 5
  Top Layer w0.254: U1.8 11.45,9.25 10.57,10.13
P3.5: length 25.4
  Top Layer w0.254: U1.12 v1(13.87,7.25) ; LED3.1 34.91,1.62 v1(33.3,1.62)
  Bottom Layer w0.254: v1(33.3,1.62) 18.82,1.62 13.87,6.57 v1(13.87,7.25)
PWM1P: length 39.7
  Top Layer w0.254: v1(36.35,39.46) 36.35,38.58 R15.2 36.86,38.06 U5.1 ; U1.40 20.58,12.81 20.98,12.41 21.75,12.41 v1(30.95,21.62)
  Bottom Layer w0.254: v1(36.35,39.46) 37.24,38.58 37.24,27.91 v1(30.95,21.62)
PWM3P: length 66.8
  Top Layer w0.254: U1.36 v1(25.05,12.75) ; U6.1 36.86,64.86 R23.2 v1(36.34,66.51)
  Bottom Layer w0.254: v1(25.05,12.75) 26.15,12.75 38.51,25.11 38.51,64.86 36.87,66.51 v1(36.34,66.51)
UCAP: length 2.7
  Top Layer w0.254: U1.29 26.11,9.25 C9.1
$1N1691: length 3.1
  Top Layer w0.254: R8.2 3.46,20.28 R9.2 R6.1
$1N5440: length 2
  Top Layer w0.254: LED1.1 27.42,41.38 R25.1
$1N5444: length 2.2
  Top Layer w0.254: R26.1 28.52,27.56 LED2.1
$1N5449: length 3
  Top Layer w0.254: R27.1 LED3.2
$1N5962: length 3.3
  Top Layer w0.254: U4.5 17.64,68.72 arc(18.39,68.41) 18.7,67.66 18.7,66.9 arc(18.69,66.9) R12.2
$1N17116: length 8.4
  Top Layer w0.254: SW1.1 3.85,54.07 R10.1 D1.2
$1N17498: length 13.3
  Top Layer w0.254: Q2.4 14.76,45.43 14.38,45.81 7.27,45.81 SW1.2
$1N21474: length 2.6
  Top Layer w0.254: R2.2 19.73,62.43 U2.5
$1N21476: length 5.9
  Top Layer w0.254: U2.1 25.68,56.09 v1(25.68,55.34) ; C1.2 v1(22.25,54.32)
  Bottom Layer w0.254: v1(22.25,54.32) 24.67,54.32 v1(25.68,55.34)
$1N21478: length 3.6
  Top Layer w0.254: U2.4 25.54,61.69 R3.2 27.2,61.82 R1.1
$1N25690:
  vias: v1(69.6,48.58) v1(69.6,47.31) v1(69.6,46.04) v1(69.6,44.77) v1(69.6,43.5) v1(70.87,48.58) v1(70.87,47.31) v1(70.87,46.04) v1(70.87,44.77) v1(70.87,43.5) v1(72.14,48.58) v1(72.14,47.31) v1(72.14,46.04) v1(72.14,44.77) v1(72.14,43.5) v1(73.41,48.58) v1(73.41,47.31) v1(73.41,46.04) v1(73.41,44.77) v1(73.41,43.5) v1(73.41,42.23) v1(73.41,40.96) v1(73.41,39.69) v1(73.41,38.42) v1(73.41,37.15) v1(73.41,35.88) v1(73.41,34.61) v1(73.41,33.34) v1(73.41,32.07) v1(73.41,30.8) v1(73.41,29.53) v1(73.41,28.26) v1(74.68,48.58) v1(74.68,47.31) v1(74.68,46.04) v1(74.68,44.77) v1(74.68,43.5) v1(74.68,42.23) v1(74.68,40.96) v1(74.68,39.69) v1(74.68,38.42) v1(74.68,37.15) v1(74.68,35.88) v1(74.68,34.61) v1(74.68,33.34) v1(74.68,32.07) v1(74.68,30.8) v1(74.68,29.53) v1(74.68,28.26) v1(75.95,53.66) v1(75.95,52.39) v1(75.95,51.12) v1(75.95,49.85) v1(75.95,48.58) v1(75.95,47.31) v1(75.95,46.04) v1(75.95,44.77) v1(75.95,43.5) v1(75.95,42.23) v1(75.95,40.96) v1(75.95,39.69) v1(75.95,38.42) v1(75.95,37.15) v1(75.95,35.88) v1(75.95,34.61) v1(75.95,33.34) v1(75.95,32.07) v1(75.95,30.8) v1(75.95,29.53) v1(75.95,28.26) v1(77.22,53.66) v1(77.22,52.39) v1(77.22,51.12) v1(77.22,49.85) v1(77.22,48.58) v1(77.22,47.31) v1(77.22,46.04) v1(77.22,44.77) v1(77.22,43.5) v1(77.22,42.23) v1(77.22,34.61) v1(77.22,33.34) v1(77.22,32.07) v1(77.22,30.8) v1(77.22,29.53) v1(77.22,28.26) v1(80.14,28.26) v1(80.14,26.99) v1(81.41,28.26) v1(81.41,26.99) v1(82.68,28.26) v1(82.68,26.99) v1(83.95,28.26) v1(83.95,26.99) v1(85.22,28.26) v1(85.22,26.99) v1(86.49,28.26) v1(86.49,26.99) v1(87.76,28.26) v1(87.76,26.99) v1(89.03,28.26) v1(89.03,26.99) v1(90.3,28.26) v1(90.3,26.99) v1(91.57,28.26) v1(91.57,26.99) v1(92.84,28.26) v1(92.84,26.99) v1(94.11,28.26) v1(94.11,26.99) v1(95.38,28.26) v1(95.38,26.99) v2(69.18,40.86) v2(69.18,39.65) v2(69.18,38.45) v2(69.18,37.24) v2(69.18,36.03) v2(69.18,34.83) v2(69.18,33.62) v2(69.18,32.42) v2(69.18,31.21) v2(69.18,30) v2(69.18,28.8) v2(69.45,52.94) v2(69.45,51.74) v2(69.45,50.54) v2(69.43,26.52) v2(70.65,52.94) v2(70.65,51.74) v2(70.65,50.54) v2(70.64,26.52) v2(71.85,52.94) v2(71.85,51.74) v2(71.85,50.54) v2(71.85,26.52) v2(73.05,52.94) v2(73.05,51.74) v2(73.05,50.54) v2(73.05,26.52) v2(74.25,52.94) v2(74.25,51.74) v2(74.25,50.54) v2(74.26,26.52) v2(75.47,26.52) v2(76.67,26.52) v2(77.56,40.86) v2(77.56,39.65) v2(77.56,38.45) v2(77.56,37.24) v2(77.56,36.03) v2(81.05,30.51) v2(82.26,30.51) v2(83.47,30.51) v2(84.67,30.51) v2(85.88,30.51) v2(87.09,30.51) v2(88.29,30.51) v2(89.5,30.51) v2(90.71,30.51) v2(91.91,30.51) v2(93.12,30.51) v2(94.33,30.51) v2(95.53,30.51)
$1N26279:
  vias: v1(84.97,40.45) v1(84.97,39.18) v1(84.97,37.91) v1(84.97,36.64) v1(84.97,35.37) v1(86.24,40.45) v1(86.24,39.18) v1(86.24,37.91) v1(86.24,36.64) v1(86.24,35.37) v1(87.51,40.45) v1(87.51,39.18) v1(87.51,37.91) v1(87.51,36.64) v1(87.51,35.37) v1(88.78,40.45) v1(88.78,39.18) v1(88.78,37.91) v1(88.78,36.64) v1(88.78,35.37) v1(90.05,40.45) v1(90.05,39.18) v1(90.05,37.91) v1(90.05,36.64) v1(90.05,35.37) v1(91.32,40.45) v1(91.32,39.18) v1(91.32,37.91) v1(91.32,36.64) v1(91.32,35.37) v1(92.59,40.45) v1(92.59,39.18) v1(92.59,37.91) v1(92.59,36.64) v1(92.59,35.37) v1(93.86,40.45) v1(93.86,39.18) v1(93.86,37.91) v1(93.86,36.64) v1(93.86,35.37) v1(95.13,40.45) v1(95.13,39.18) v1(95.13,37.91) v1(95.13,36.64) v1(95.13,35.37) v1(96.4,40.45) v1(96.4,39.18) v1(96.4,37.91) v1(96.4,36.64) v1(96.4,35.37) v1(97.67,40.45) v1(97.67,39.18) v1(97.67,37.91) v1(97.67,36.64) v1(97.67,35.37) v1(98.94,40.45) v1(98.94,39.18) v1(98.94,37.91) v1(98.94,36.64) v1(98.94,35.37) v2(80.74,40.86) v2(80.74,39.65) v2(80.74,38.45) v2(80.74,37.24) v2(80.74,36.03) v2(81.05,33.69) v2(82.26,33.69) v2(83.47,33.69) v2(84.67,33.69) v2(85.88,33.69) v2(87.09,33.69) v2(88.29,33.69) v2(89.5,33.69) v2(90.71,33.69) v2(91.91,33.69) v2(93.12,33.69) v2(94.33,33.69) v2(95.53,33.69)
$1N26815: length 6.8
  Top Layer w0.254: U4.8 16.78,73.81 arc(17.47,75.48) R11.1
  vias: v2(18.31,78.31) v2(18.31,77.24) v2(18.31,76.17) v2(18.31,75.09) v2(18.31,74.02) v2(19.95,78.31) v2(19.95,77.24) v2(19.95,76.17) v2(19.95,75.09) v2(19.95,74.02) v2(21.77,76.08) v2(21.77,74.88) v2(21.77,73.68) v2(21.77,72.48) v2(21.77,71.28) v2(21.77,70.08) v2(21.77,68.88) v2(22.97,76.08) v2(22.97,74.88) v2(22.97,73.68) v2(22.97,72.48) v2(22.97,71.28) v2(22.97,70.08) v2(22.97,68.88) v2(22.97,67.68) v2(24.17,73.68) v2(24.17,72.48) v2(24.17,71.28) v2(24.17,70.08) v2(24.17,68.88) v2(24.17,67.68) v2(25.37,71.28) v2(26.57,71.28) v2(27.77,71.28) v2(28.97,74.88) v2(28.97,73.68) v2(28.97,72.48) v2(28.97,71.28) v2(28.97,70.08) v2(28.97,68.88) v2(28.97,67.68) v2(40.54,59.46) v2(40.53,56.78) v2(40.53,55.58) v2(40.53,54.38) v2(40.53,53.18) v2(40.53,51.98) v2(40.53,50.78) v2(40.53,49.58) v2(40.54,46.9) v2(40.54,34.06) v2(40.53,31.38) v2(40.53,30.18) v2(40.53,28.98) v2(40.53,27.78) v2(40.53,26.58) v2(40.53,25.38) v2(40.53,24.18) v2(41.75,59.46) v2(41.73,56.78) v2(41.73,55.58) v2(41.73,54.38) v2(41.73,53.18) v2(41.73,51.98) v2(41.73,50.78) v2(41.73,49.58) v2(41.75,46.9) v2(41.75,34.06) v2(41.73,31.38) v2(41.73,30.18) v2(41.73,28.98) v2(41.73,27.78) v2(41.73,26.58) v2(41.73,25.38) v2(41.73,24.18) v2(42.93,56.78) v2(42.93,55.58) v2(42.93,54.38) v2(42.93,53.18) v2(42.93,51.98) v2(42.93,50.78) v2(42.93,49.58) v2(42.93,31.38) v2(42.93,30.18) v2(42.93,28.98) v2(42.93,27.78) v2(42.93,26.58) v2(42.93,25.38) v2(42.93,24.18) v2(42.95,59.46) v2(42.95,46.9) v2(42.95,34.06) v2(44.13,56.78) v2(44.13,55.58) v2(44.13,54.38) v2(44.13,53.18) v2(44.13,51.98) v2(44.13,50.78) v2(44.13,49.58) v2(44.13,31.38) v2(44.13,30.18) v2(44.13,28.98) v2(44.13,27.78) v2(44.13,26.58) v2(44.13,25.38) v2(44.13,24.18) v2(44.16,59.46) v2(44.16,46.9) v2(44.16,34.06) v2(45.33,56.78) v2(45.33,55.58) v2(45.33,54.38) v2(45.33,53.18) v2(45.33,51.98) v2(45.33,50.78) v2(45.33,49.58) v2(45.33,31.38) v2(45.33,30.18) v2(45.33,28.98) v2(45.33,27.78) v2(45.33,26.58) v2(45.33,25.38) v2(45.33,24.18) v2(45.37,59.46) v2(45.37,46.9) v2(45.37,34.06)
$1N28111: length 15.7
  Top Layer w0.254: Q6.1 51.72,70.07 R24.2 R28.2
$1N28126: length 2.3
  Top Layer w0.254: D7.2 34.78,70.07 R24.1
$1N28132: length 7.3
  Top Layer w0.254: U6.4 33.05,66.3 D7.1 34.78,68.04 R28.1
$1N28147: length 17.4
  Top Layer w0.254: R20.2 R21.2 ; Q5.1 50.29,48.95 47.02,45.69 39.51,45.69 38.11,47.08
$1N28152: length 10.4
  Top Layer w0.254: U6.7 35.59,49.64 R21.1 34.66,49.24 D5.1
$1N28166: length 2.2
  Top Layer w0.254: R20.1 34.78,47.08 D5.2
$1N28183: length 16.9
  Top Layer w0.254: Q4.1 51.4,45.05 39.53,45.05 38.11,43.64 R16.2 R17.2
$1N28208: length 6.7
  Top Layer w0.254: R17.1 34.78,41.11 D4.1 33.05,39.38 U5.4
$1N28222: length 2.3
  Top Layer w0.254: R16.1 34.78,43.15 D4.2
$1N28228: length 16
  Top Layer w0.254: 38.11,23.97 38.11,21.94 48.67,21.94 50.29,23.56 Q3.1
$1N28245: length 9.5
  Top Layer w0.254: U5.7 35.59,24.37 R14.1 34.78,23.97 D2.1
$1N28259: length 2.3
  Top Layer w0.254: 36.11,21.94 34.78,21.94 D2.2
$1N28378: length 5.3
  Top Layer w0.254: U6.8 36.86,55.27 C35.1 37.32,53.67 D6.1
$1N28442: length 4.8
  Top Layer w0.254: D3.1 37.32,27.89 C32.1 36.86,29.49 U5.8

## Copper pours and planes (outline as drawn; the poured copper is in the pictures)
+5V on Top Layer: 15.9,33.62 15.9,31.26 14.53,29.89 14.53,27.14 18.95,27.14 18.95,33.62
+12V on Top Layer: 21.62,53.05 21.62,48.99 15.9,43.27 15.9,36.67 19.08,36.67 19.08,42.26 20.6,43.78 26.95,43.78 26.95,53.05
+12V on Top Layer: 28.27,32.07 33.43,32.07 33.43,29.3 28.27,29.3
+12V on Top Layer: 28.27,58.36 33.43,58.36 33.43,56.36 28.27,56.36
+12V on 电源层: 28.27,31.3 33.43,31.3 33.43,29.3 28.27,29.3
+12V on 电源层: 24.41,48.1 24.41,48.73 26.7,51.02 29.37,51.02 30.08,51.74 30.08,54.5 28.25,56.33 28.25,58.36 32.51,58.36 32.51,50.36 31.27,49.12 28.48,49.12 27.46,48.1
+12V on 电源层: 27.84,32.26 27.84,48.48 24.41,48.48 24.41,40.86 26.19,39.08 26.19,31.39 28.27,29.3 29.63,29.3 29.63,30.47
+24V on Top Layer: 9.43,57.92 20.33,57.92 20.33,55.74 9.43,55.74
+24V on Top Layer: 9.43,80.44 4.44,75.45 4.44,55.72 9.68,55.72 9.68,71.21 11.84,73.37 11.84,80.44
+24V on Top Layer: 10.19,46.32 10.19,50.13 4.22,56.1 18.57,56.1 18.57,48.61 16.28,46.32
+24V on 电源层: 10.19,46.32 10.19,50.13 4.47,55.85 16.79,55.85 16.79,47.97 15.14,46.32
+24V on 电源层: 8.16,79.17 4.44,75.45 4.44,55.72 9.68,55.72 9.68,71.21 11.84,73.37 11.84,79.17
+24V on 电源层: 9.43,57.92 16.77,57.92 16.77,55.74 9.43,55.74
AGND on Top Layer: 11.58,68.93 14.61,68.93 14.61,66.26 11.58,66.26
GND on Top Layer: -0.85,26.13 9.03,26.13 12.95,30.05 12.95,39.44 17.43,43.91 27.33,43.91 27.33,24.22 32.29,19.27 55.91,19.27 58.32,16.86 58.32,-2.45 -0.48,-2.45 -1.11,-1.81 -1.11,25.86
GND on Bottom Layer: -0.98,26.13 8.9,26.13 12.83,30.05 12.83,39.44 17.3,43.91 27.21,43.91 27.21,24.22 32.16,19.27 55.78,19.27 58.32,16.73 58.32,-2.45 -0.61,-2.45 -1.24,-1.81 -1.24,25.86
GND on GND层: -0.85,26.13 9.03,26.13 12.95,30.05 12.95,39.44 17.43,43.91 27.33,43.91 27.33,24.22 32.29,19.27 55.91,19.27 58.32,16.86 58.32,-2.45 -0.48,-2.45 -1.11,-1.81 -1.11,25.86
PGND on Top Layer: 39.4,69.31 53.37,69.31 53.37,61.82 39.4,61.82
PGND on Top Layer: 39.4,44.5 53.37,44.5 53.37,36.38 39.4,36.38
PGND on Top Layer: -11.66,28.03 10.19,28.03 12.47,30.32 12.47,39.72 18.95,46.19 27.88,46.19 27.88,25.58 32.92,20.54 53.37,20.54 53.37,83.66 -5.43,83.66 -11.66,77.44
PGND on Bottom Layer: -11.66,28.03 10.19,28.03 12.47,30.32 12.47,39.72 18.95,46.19 27.88,46.19 27.88,25.58 32.92,20.54 53.37,20.54 53.37,83.66 -5.43,83.66 -11.66,77.44
PGND on GND层: -11.66,28.03 10.19,28.03 12.47,30.32 12.47,39.72 18.95,46.19 27.88,46.19 27.88,25.58 32.92,20.54 53.37,20.54 53.37,83.66 -5.43,83.66 -11.66,77.44
VIN on Top Layer: -1.24,45.94 15.39,45.94 15.39,40.23 -1.24,40.23
OUT1 on Top Layer: 54.64,71.72 54.64,61.17 51.69,58.22 50.12,58.22 50.12,49.75 58.7,49.75 68.35,59.4 75.47,59.4 75.47,71.72
OUT1 on Bottom Layer: 54.64,71.72 54.64,49.75 58.7,49.75 68.35,59.4 75.47,59.4 75.47,71.72
OUT1 on GND层: 54.64,71.72 54.64,49.75 58.7,49.75 68.35,59.4 75.47,59.4 75.47,71.72
OUT1 on 电源层: 54.64,71.72 54.64,61.17 51.69,58.22 50.12,58.22 50.12,49.75 58.7,49.75 68.35,59.4 75.47,59.4 75.47,71.72
OUT2 on Top Layer: 54.64,45.58 54.64,35.77 51.69,32.82 50.12,32.82 50.12,24.27 50.07,24.22 53.62,24.22 60.35,17.49 106.84,17.49 106.84,24.48 66.83,24.48 66.83,42.07 63.32,45.58
OUT2 on Bottom Layer: 54.64,45.58 54.64,23.21 60.35,17.49 106.84,17.49 106.84,24.48 66.83,24.48 66.83,42.07 63.32,45.58
OUT2 on GND层: 54.64,45.58 54.64,23.21 60.35,17.49 106.84,17.49 106.84,24.48 66.83,24.48 66.83,42.07 63.32,45.58
OUT2 on 电源层: 54.64,45.58 54.64,35.77 51.69,32.82 50.12,32.82 50.12,24.27 50.07,24.22 53.62,24.22 60.35,17.49 106.84,17.49 106.84,24.48 66.83,24.48 66.83,42.07 63.32,45.58
P5.1 on Top Layer: 22.76,7.33 24.28,7.33 24.28,5.94 22.76,5.94
P5.3 on Top Layer: 14.38,13.94 15.27,13.94 15.27,12.67 14.38,12.67
$1N21475 on Top Layer: 18.82,56.61 20.35,56.61 20.35,49.12 18.82,49.12
$1N25690 on Top Layer: 74.96,31.34 96.93,31.34 96.93,25.62 74.96,25.62
$1N25690 on Top Layer: 68.23,54.58 78.39,54.58 78.39,25.62 68.23,25.62
$1N25690 on Bottom Layer: 74.96,31.34 96.93,31.34 96.93,25.62 74.96,25.62
$1N25690 on Bottom Layer: 68.23,54.58 78.39,54.58 78.39,25.62 68.23,25.62
$1N25690 on GND层: 74.96,31.34 96.93,31.34 96.93,25.62 74.96,25.62
$1N25690 on GND层: 68.23,54.58 78.39,54.58 78.39,25.62 68.23,25.62
$1N25690 on 电源层: 68.23,54.58 78.39,54.58 78.39,25.62 68.23,25.62
$1N26279 on Top Layer: 79.78,42 79.78,32.73 101.12,32.73 101.12,42
$1N26279 on Bottom Layer: 79.78,42 79.78,32.73 101.12,32.73 101.12,42
$1N26279 on GND层: 79.78,42 79.78,32.73 101.12,32.73 101.12,42
$1N26279 on 电源层: 79.78,42 79.78,32.73 101.12,32.73 101.12,42
$1N26815 on Top Layer: 17.36,80.06 17.36,71.74 22.12,66.98 29.68,66.98 29.68,75.57 24.71,75.57 20.22,80.06
$1N26815 on Top Layer: 39.53,60.42 39.53,46.07 46.26,46.07 48.37,48.18 48.38,48.18 48.38,58.17 46.13,60.42
$1N26815 on Top Layer: 39.53,34.89 39.53,22.7 48.54,22.7 48.54,32.73 46.38,34.89
$1N26815 on 电源层: 17.43,82.14 17.43,71.68 22.12,66.98 38.13,66.98 38.13,82.14
$1N26815 on 电源层: 37.11,80.36 46.26,80.36 46.26,22.7 37.11,22.7
$1N33414 on Top Layer: -1.75,40.1 15.39,40.1 15.39,35.27 -1.75,35.27

Small or netless copper shapes (teardrops, artwork), in the pictures only: 194 on Top Layer, 24 on Bottom Layer, 10 on 电源层

## Text on the board
Top Layer: 华东理工大学 / 起源-20th / 2025.6.12
Top Silkscreen Layer: +5V | RX | TX | GND | P1.2 | 12V | 5V | 指 / 示 / 灯 | 启/停 | 开
